# EAGLE design amplificadorv7 (EAGLE 7.7.0)
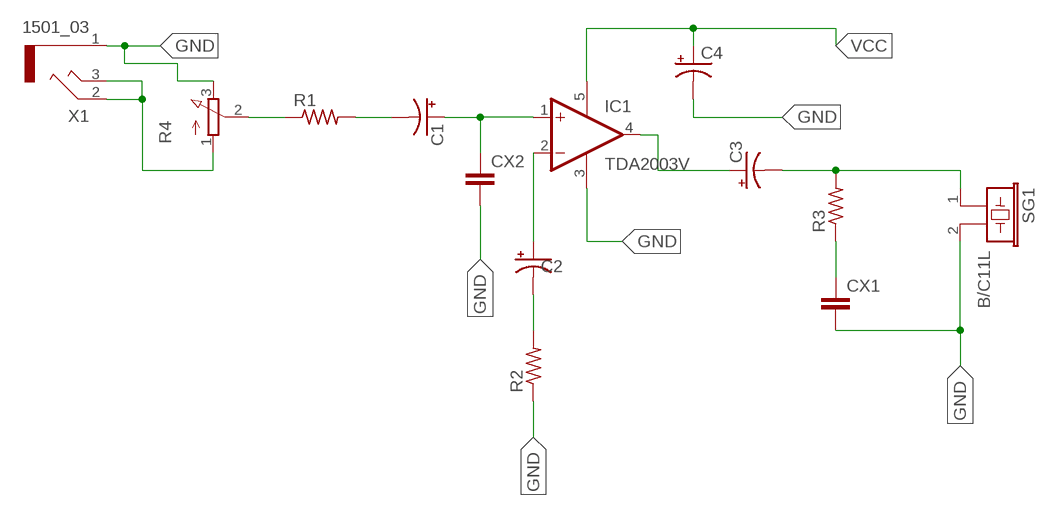
[diagram p0: schematic, sheet 1]

## Parts
C1  CPOL-USB45181B  [B45181B]
C2  CPOL-USB45181B  [B45181B]
C3  CPOL-USB45181B  [B45181B]
C4  CPOL-USB45181B  [B45181B]
CX1  CXXC10B6  [XC10B6]
CX2  CXXC10B6  [XC10B6]
IC1  TDA2003V  [CB360]
R1  R-US_0204/7  [0204/7]
R2  R-US_0204/7  [0204/7]
R3  R-US_0204/7  [0204/7]
R4  3RP/1610N  [3RP/1610N]
SG1  B/C11L  [B/C11L]
X1  1501_03  [1501_03]

## Nets
GND: C4.- CX1.2 CX2.2 IC1.3(GND) R2.1 R4.3(E) SG1.2 X1.1
N$1: C1.- R1.2
N$2: C1.+ CX2.1 IC1.1(+IN)
N$3: C2.+ IC1.2(-IN)
N$4: C2.- R2.2
N$5: R1.1 R4.2(S)
N$6: C3.+ IC1.4(OUT)
N$7: C3.- R3.2 SG1.1
N$8: CX1.1 R3.1
N$9: R4.1(A) X1.2 X1.3
VCC: C4.+ IC1.5(V+)

## Library data of the parts
C1-C4 = rcl:CPOL-US: POLARIZED CAPACITOR, American symbol; SPICEPREFIX: C
CX1 CX2 = rcl:CX: X CAPACITOR for power line; SPICEPREFIX: C
IC1 = linear:TDA2003: AUDIO AMPLIFIER
R1-R3 = rcl:R-US_: RESISTOR, American symbol; SPICEPREFIX: R
R4 = pot:3RP/1610N: 16mm Potentiometer one level Source: http://www.alphapotentiometers.net/html/16mm_pot_2.html
SG1 = buzzer:B/C11L: BUZZER Source: Buerklin; OC_FARNELL: unknown; OC_NEWARK: unknown
X1 = con-lumberg:1501_03: Klinkensteckverbinder nach JISC 6560, 2,5 mm Jack connectors according to JISC 6560, 2.5 mm Source: http://www.lumberg.com/Produkte/PDFs/1501_03.pdf; OC_FARNELL: 1200127; OC_NEWARK: unknown

## Board
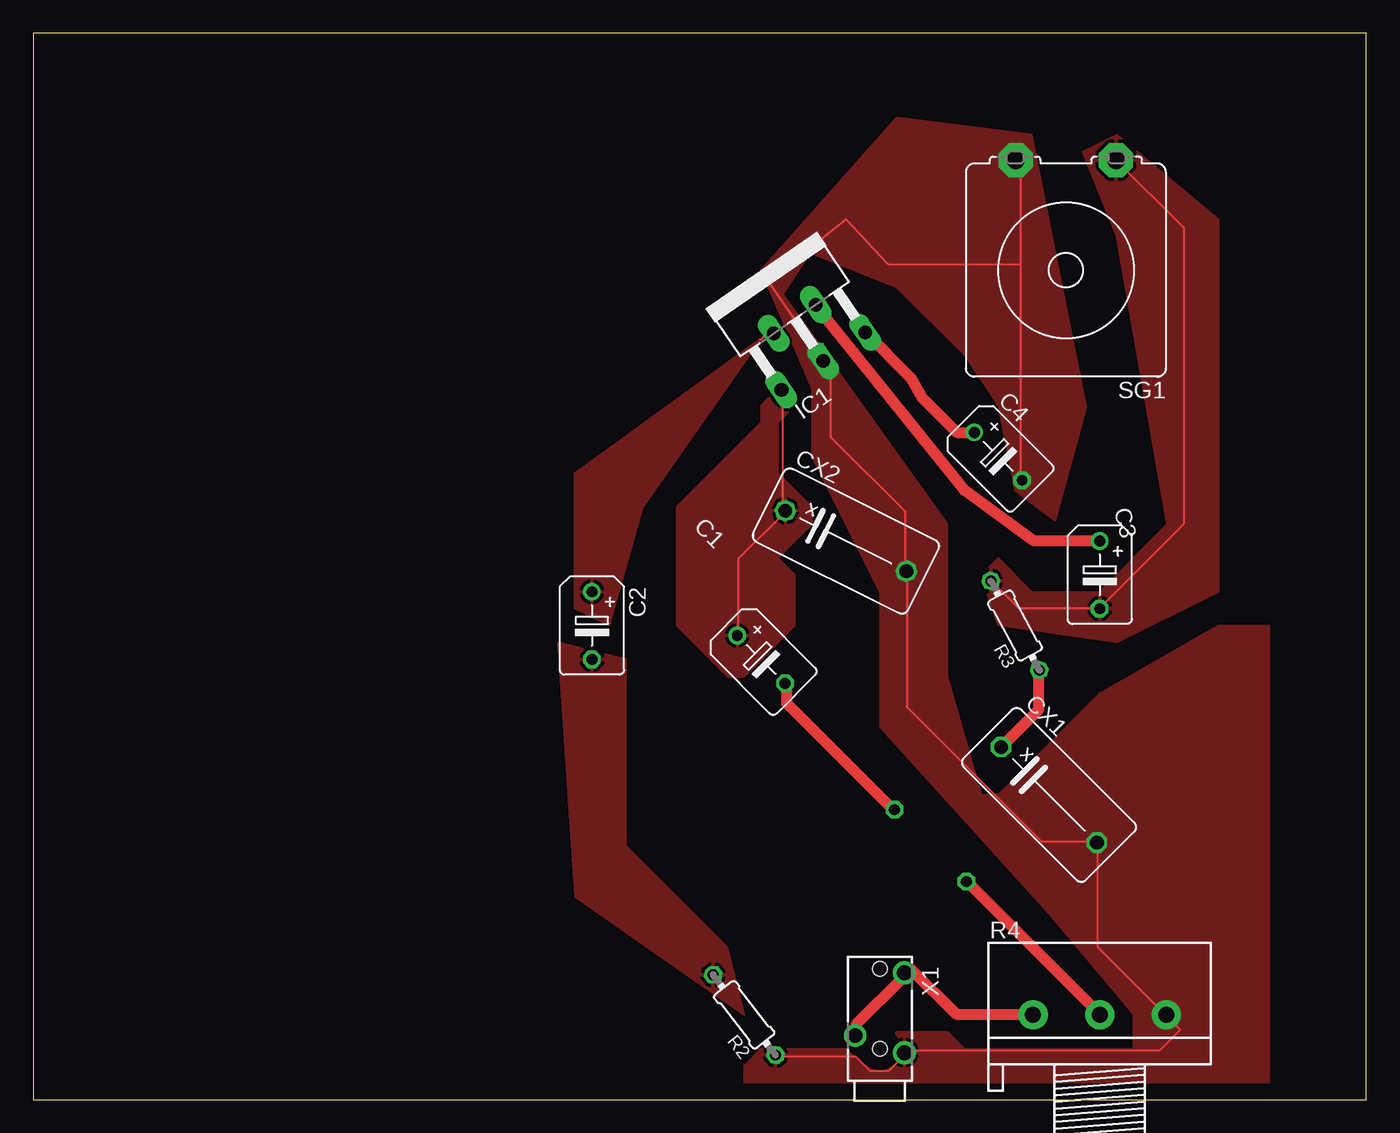
[diagram p1: board, top side]
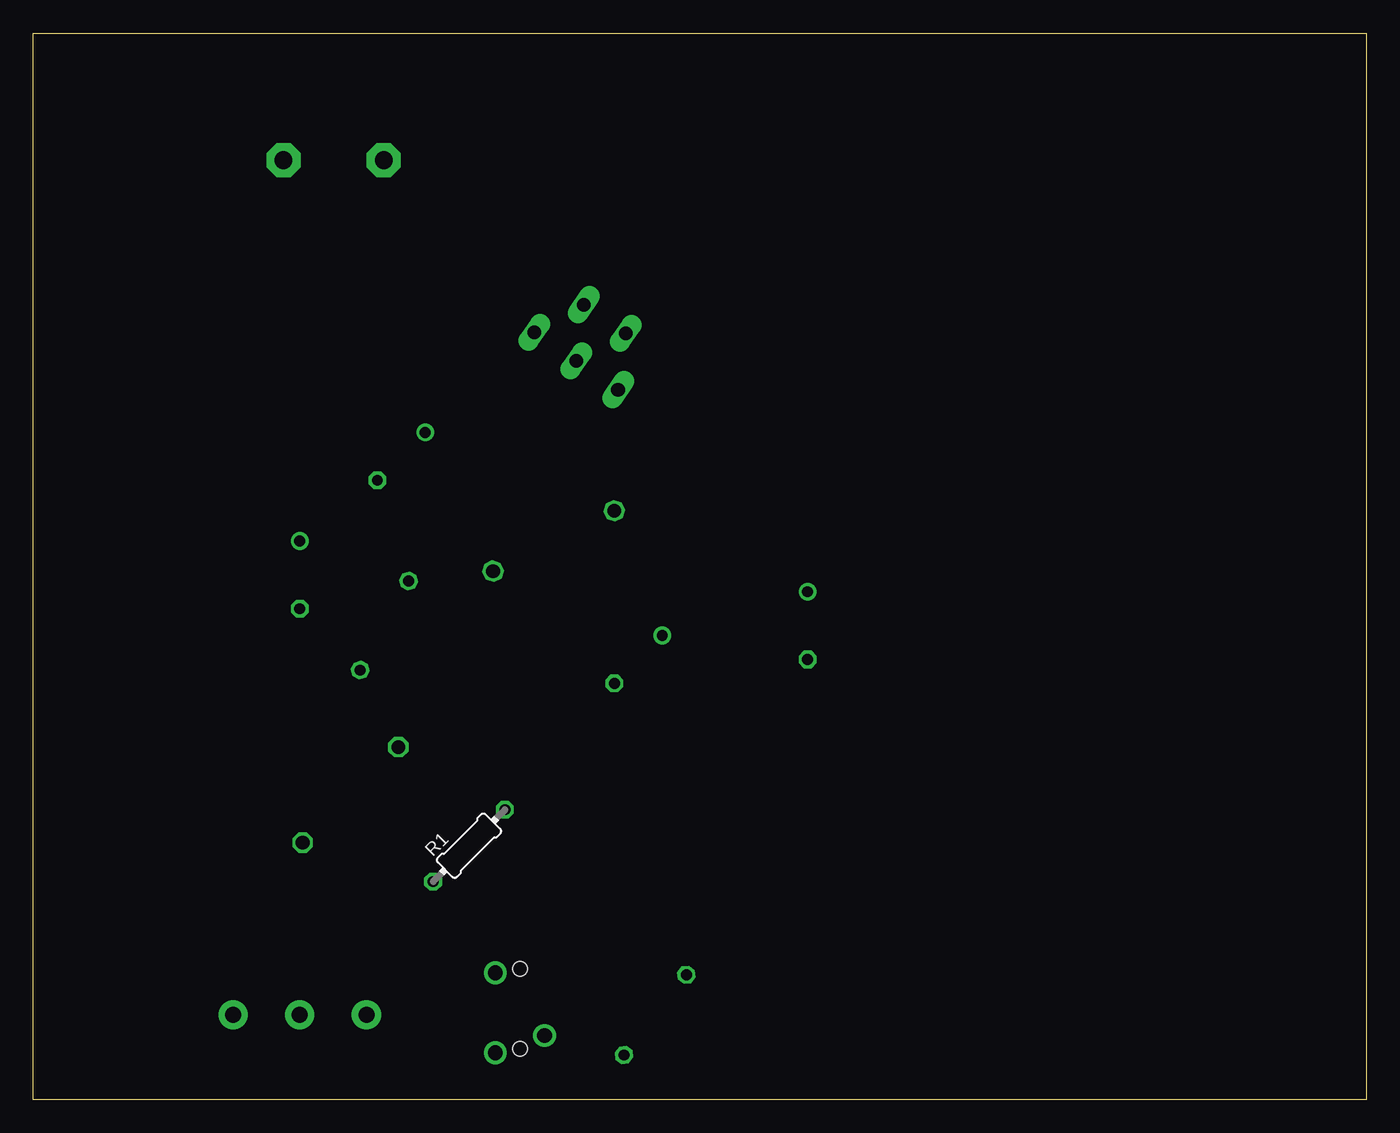
[diagram p2: board, bottom side, seen from below]

Size 100 x 80 mm. Coordinates in mm from the lower left corner, seen from the top.
Outline: 0,0 100,0 100,80 0,80 0,0
Copper layers (1*16): Top 0.035mm / dielectric 1.5mm / Bottom 0.035mm
Design rules "default": minimum track width 6mil, minimum drill 0.35mm, track to track 6mil, track to pad 6mil, pad to pad 6mil, via to via 6mil, smd to smd 6mil, copper to edge 40mil, drill to drill 6mil, minimum pad ring 10mil, minimum via ring 8mil, stop-mask expansion 4mil, vias tented up to drill 0mil, thermal gap 10mil

### Footprints (pad centres in the part's own frame; a part is rotated, then mirrored left to right if it is on the bottom)
B45181B = drill 0.813: + -2.54,0 | drill 0.813 octagon: - 2.54,0
XC10B6 = drill 1.016 octagon: 1 -5.08,0; 2 5.08,0
CB360 = drill 1.016 long: 1 -3.81,-8.255; 2 -1.905,-4.445; 3 0,-8.255; 4 1.905,-4.445; 5 3.81,-8.255
0204/7 = drill 0.813 octagon: 1 -3.81,0; 2 3.81,0
3RP/1610N = drill 1.2 pad 2.184: 1 -5,0; 2 0,0; 3 5,0
B/C11L = drill 1.321 pad 2.54 octagon: 1 -3.759,-8.255; 2 3.759,-8.255
1501_03 = drill 1.1 pad 1.7: 1 -1.85,0.3; 2 1.85,-1; 3 -1.85,-5.7 | hole 1.1: 0,0; 0,-6

### Placement (x,y rotation side)
C1  54.61,33.02 315 top
C2  41.91,35.56 270 top
C3  80.01,39.37 270 top
C4  72.39,48.26 315 top
CX1  76.2,22.86 315 top
CX2  60.96,41.91 333.5 top
IC1  54.61,62.23 34.4 top
R1  67.31,19.05 45 bottom
R2  53.34,6.35 127.9 top
R3  73.66,35.56 118.6 top
R4  80.01,6.35 0 top
SG1  77.47,62.23 180 top
X1  63.5,3.81 180 top

### Tracks (layer width: path | path; a pad name or v marks a point on that pad's centre or on a via)
GND
  Top 0.152: R2.1 55.78,3.2 61.72,3.2 62.79,2.13 64.16,2.13 65.23,3.2 65.23,3.5 X1.1 65.38,3.66 84.48,3.66 86.06,5.23 84.89,6.4 | 84.89,6.4 79.86,11.43 79.86,13.97 79.86,19.2 CX1.2 79.7,19.36 75.64,19.36 65.53,29.46 65.53,39.62 CX2.2 65.38,39.78 65.38,44.15 59.85,49.67 59.85,54.02 arc45 IC1.3 | 84.89,6.4 R4.3 | 74.07,62.69 74.07,70.1 73.76,70.41 SG1.2 | 74.07,62.69 74.07,46.48 C4.- | 74.07,62.69 64.13,62.69 60.96,66.04 55.17,61.41 IC1.3 | IC1.3 59.27,56.69
  pour Top (no thermals): 63.5,27.94 76.2,13.97 82.55,6.35 85.46,2.47 88.9,7.62 82.09,12.48 83.82,22.86 71.12,22.86 68.58,31.75 68.58,43.18 56.25,60.44 58.32,63.54 64.77,60.96 69.85,55.88 72.39,52.07 73.66,45.72 76.69,43.44 79.02,51.96 74.93,72.39 64.77,73.66 54.61,62.23 58.42,53.34 58.42,48.26 63.5,38.1
  pour Top: 54.61,3.81 60.96,3.81 62.23,2.54 63.5,2.54 63.5,3.81 64.77,5.08 68.58,5.08 69.85,3.81 82.55,3.81 82.55,7.62 85.09,10.16 91.44,10.16 92.71,8.89 92.71,1.27 53.34,1.27 53.34,2.54
  pour Top: 72.39,22.86 80.01,30.48 88.9,35.56 92.71,35.56 92.71,6.35 81.28,8.89
N$1
  Top 0.152: 56.54,31.09 C1.- | 64.47,21.79 R1.2
  Top 0.813: 56.54,31.09 56.54,29.72 64.47,21.79
N$2
  Top 0.152: C1.+ 52.88,34.9 52.88,40.54 56.39,44.04 CX2.1 56.39,44.2 56.24,44.35 56.24,53.19 IC1.1
  pour Top: 54.61,52.07 54.61,50.8 48.26,44.45 48.26,35.56 52.07,31.75 53.34,31.75 57.15,35.56 57.15,39.37 55.88,40.64 58.42,43.18 58.42,44.45 55.88,46.99 55.88,50.8 57.15,52.07 55.88,53.34
N$3
  Top 0.152: IC1.2 55.47,57.45 55.02,57.45 54.56,57 54.53,57.04
  pour Top: 40.64,36.83 40.64,46.99 54.61,57.15 45.72,44.45 43.18,35.56
N$4
  pour Top (isolate 0.406): 39.37,34.29 40.64,15.24 53.34,6.35 52.07,11.43 44.45,19.05 44.45,33.02
N$5
  Top 0.152: 70.1,16.31 R1.1 | 80.01,6.4 R4.2
  Top 0.813: 80.01,6.4 70.1,16.31
N$6
  Top 0.152: 58.67,59.59 58.68,59.59 IC1.4
  Top 0.813: C3.+ 75.08,41.91 69.85,45.72 58.68,59.59
N$7
  Top 0.152: 80.01,36.88 73.91,36.88 71.93,38.86 R3.2 | SG1.1 86.31,65.41 86.31,43.18 80.01,36.88 | 80.01,36.88 C3.-
  pour Top: 72.39,40.64 74.93,38.1 80.01,38.1 85.09,43.18 81.28,64.77 78.74,71.12 81.28,72.39 88.9,66.04 88.9,38.1 81.28,34.29 72.39,35.56 71.12,39.37
N$8
  Top 0.152: 75.44,32.16 R3.1 | 72.69,26.52 CX1.1
  Top 0.813: 75.44,32.16 75.44,29.26 72.69,26.52
N$9
  Top 0.152: 65.86,9.78 65.23,9.14 | 65.23,9.14 65.23,9.45 X1.3 65.23,9.14 | 74.98,6.4 R4.1
  Top 0.813: 65.23,9.14 61.72,5.64 61.72,4.88 X1.2 | 74.98,6.4 69.24,6.4 65.86,9.78
VCC
  Top 0.813: IC1.5 65.8,54.19 66.66,52.68 69.29,50.06 C4.+